# Altium schematic sheet Schematic.SchDoc
size 420 x 297 mm; SheetNumber: 3; SheetTotal: 4
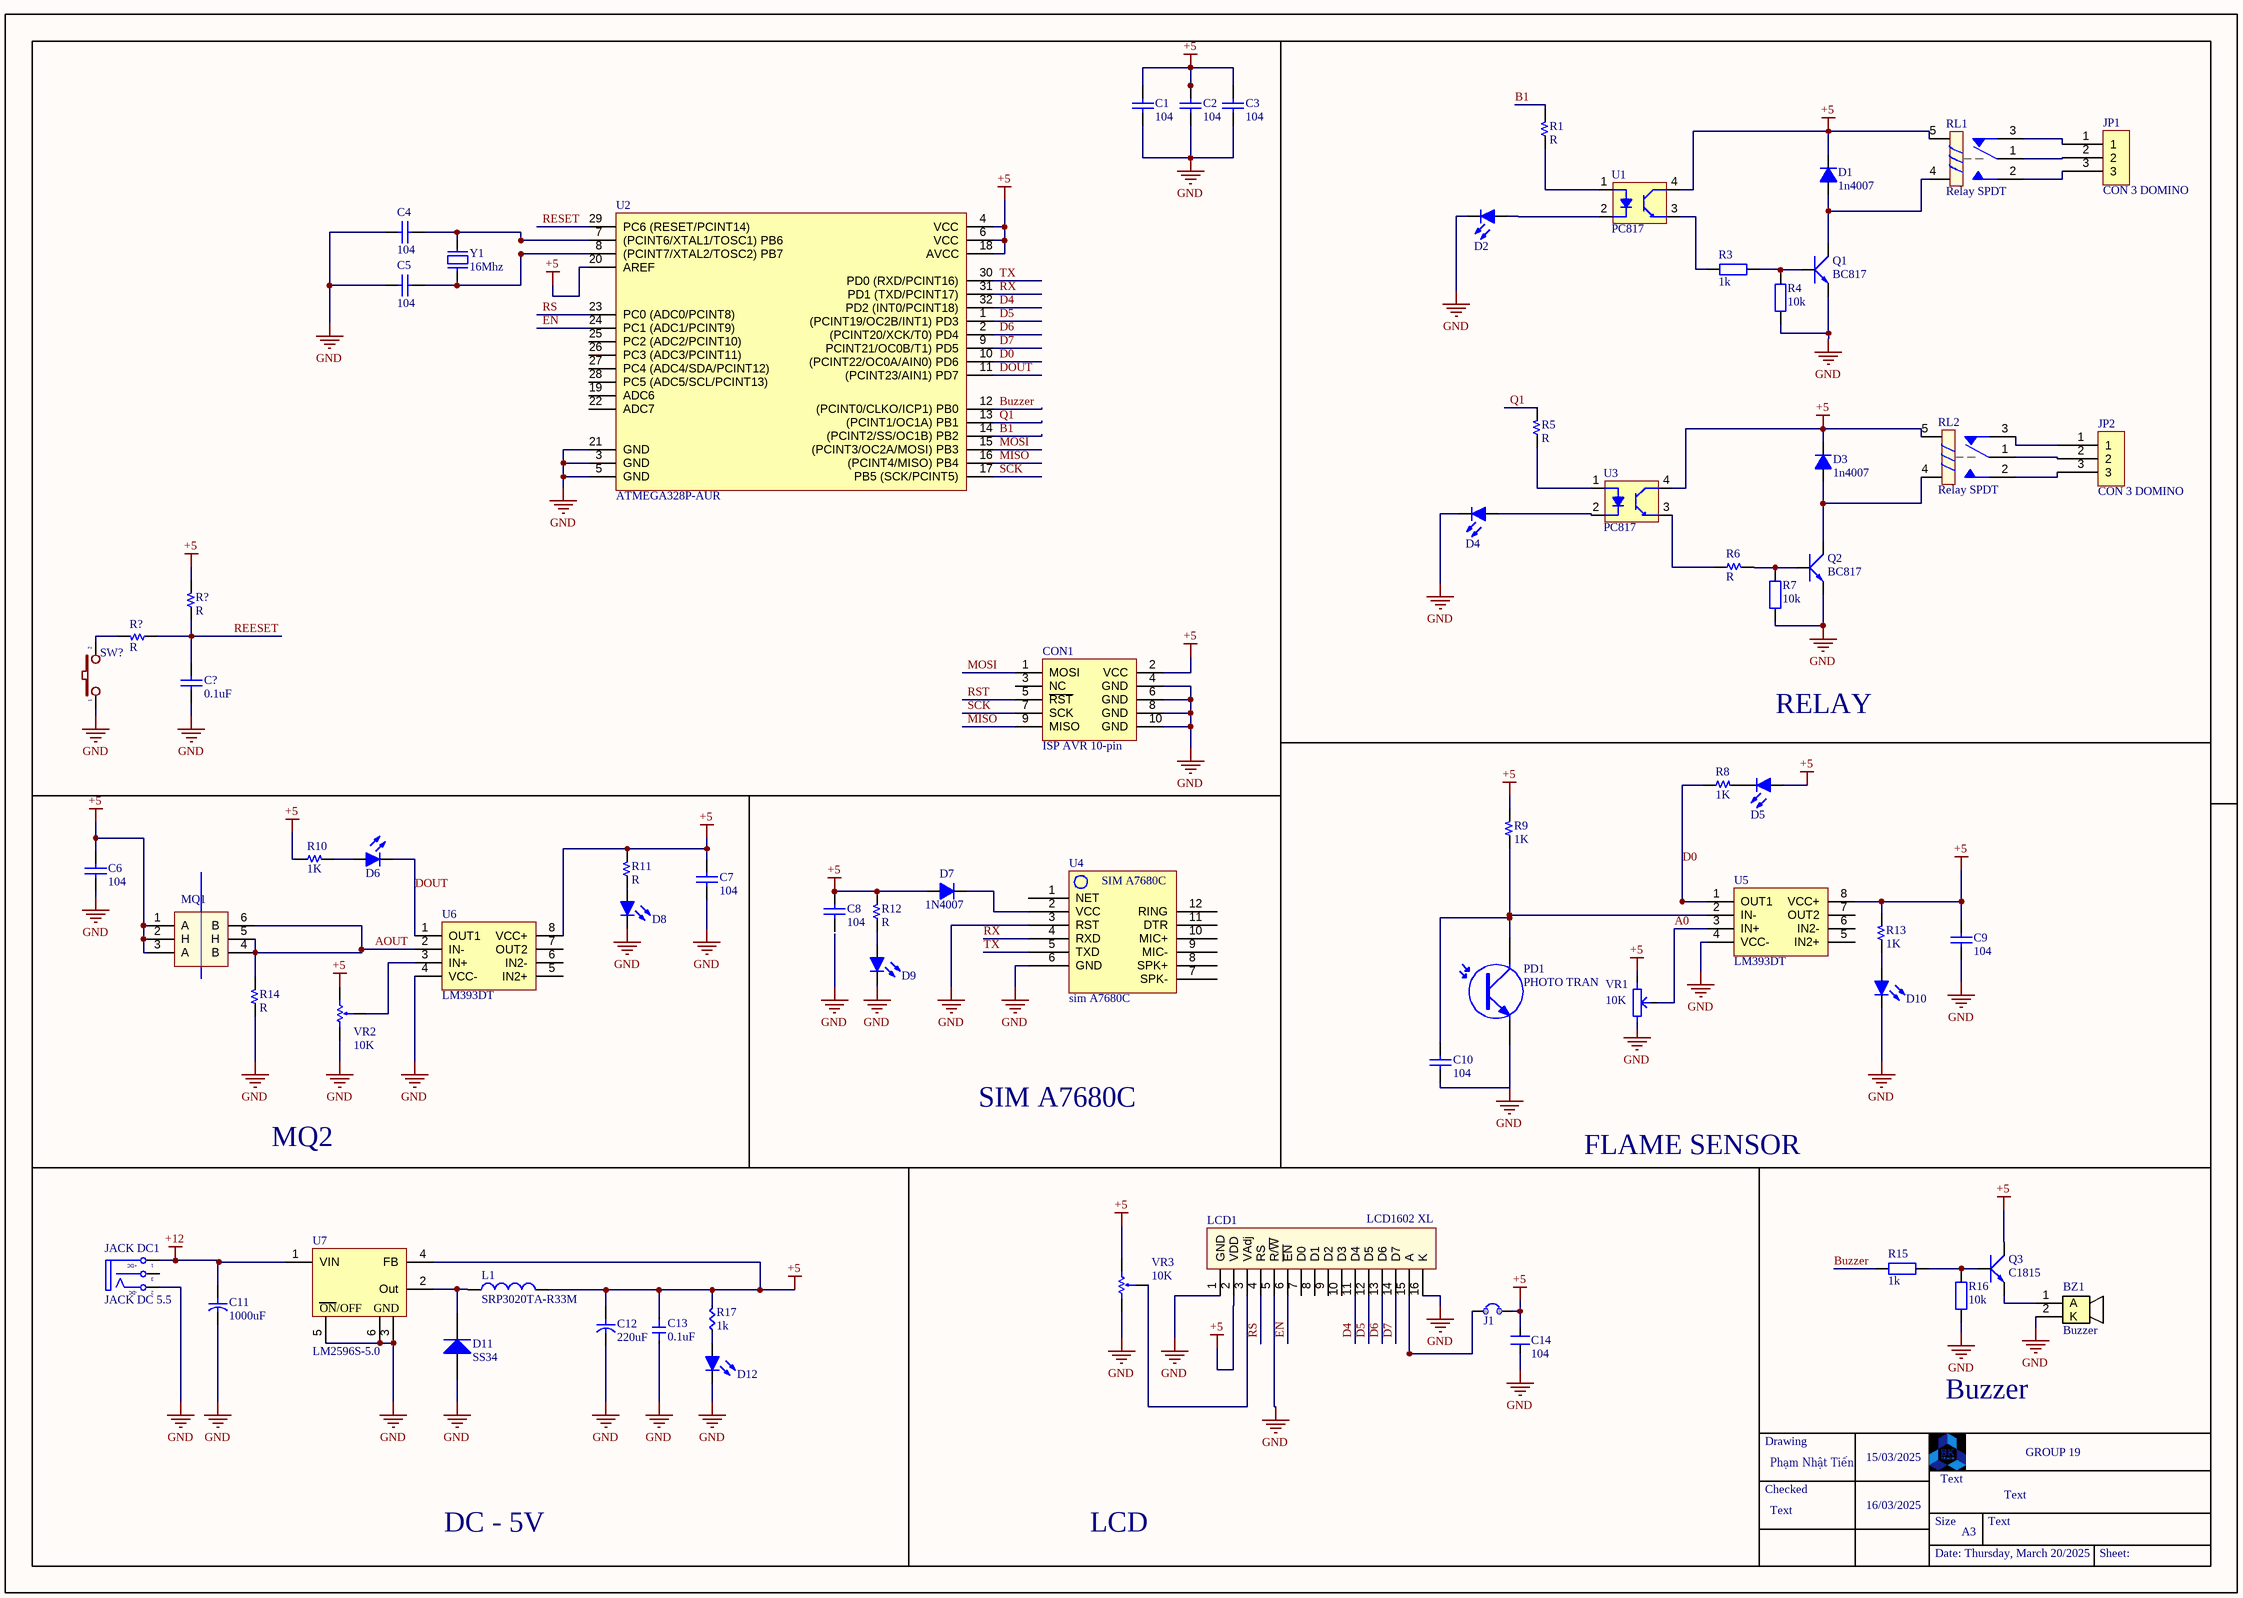
[diagram p0: Schematic.SchDoc]

## Parts
(Parts that share a designator on the sheet are numbered #1, #2 ... from top to bottom, then left to right.)
BZ1  Buzzer  [BUZZER-2]
C1  104  [tu 0805]
C2  104  [tu 0805]
C3  104  [tu 0805]
C4  104  [tu 1206]
C5  104  [tu 1206]
C6  104  [tu 1206]
C7  104  [tu 1206]
C8  104  [tu 1206]
C9  104  [tu 1206]
C10  104  [tu 0805]
C11  1000uF  [C SMD ALU (F) DUAL]
C12  220uF  [C SMD ALU (F) DUAL]
C13  0.1uF  [Cap 0201]
C14  104  [SM-0805]
C?  value 0.1uF  [C3MM]  (hidden comment: Cap)
CON1  ISP AVR 10-pin  [HDR/Header/10/DL/BOX]
D1  1n4007  [DIODE 1A]
D2  Led  [LED 5MM - RED]  (value not drawn)
D3  1n4007  [DIODE 1A]
D4  Led  [LED 5MM - RED]  (value not drawn)
D5  Led  [Led 0603 - green]  (value not drawn)
D6  Led  [Led 0603 - green]  (value not drawn)
D7  1N4007  [DIODE 1A]
D8  Led  [LED 5MM - GREEN]  (value not drawn)
D9  Led  [LED 5MM - GREEN]  (value not drawn)
D10  Led  [Led 0603 - green]  (value not drawn)
D11  SS34  [DIODE SMA]
D12  Led  [LED 5MM - RED]  (value not drawn)
J1  JUMP 2  [JUMP/2/Close]  (value not drawn)  (no BOM)
JACK_DC1  JACK DC 5.5  [JACK DC 5.5]
JP1  CON 3 DOMINO  [CON 3]
JP2  CON 3 DOMINO  [CON 3]
L1  SRP3020TA-R33M  [IND_456_640_236X117_SMD]
LCD1  LCD1602 XL  [LCD1602 with Jump]
MQ1  (no value)  [MQx]
PD1  PHOTO TRAN  [LED-5TRED]
Q1  BC817  [SOT-23]
Q2  BC817  [SOT-23]
Q3  C1815  [TO92]
R1  R  [R 1206]
R3  1k  [tro vach 1/4w]
R4  10k  [tro vach 1/4w]
R5  R  [R 1206]
R6  R  [R 1206]
R7  10k  [tro vach 1/4w]
R8  1K  [R 0603]
R9  1K  [R 0603]
R10  1K  [R 0402 (1005)]
R11  R  [R 1/4W/300]
R12  R  [R 1/4W/300]
R13  1K  [R 0603]
R14  R  [R 0402 (1005)]
R15  1k  [tro vach 1/4w]
R16  10k  [tro vach 1/4w]
R17  1k  [RES 0402]
R?#1  R  [R 1/4W/300]
R?#2  R  [R 1/4W/300]
RL1  Relay SPDT  [RL_SPDT_10A]
RL2  Relay SPDT  [RL_SPDT_10A]
SW?  SW  [SW2]  (value not drawn)
U1  PC817  [SOP4 - PC817]
U2  ATMEGA328P-AUR  [TQFP-32]
U3  PC817  [SOP4 - PC817]
U4  sim A7680C  [SIM A7680C]
U5  LM393DT  [SOIC8_50_328_25X90_SMT]
U6  LM393DT  [SOIC8_50_328_25X90_SMT]
U7  LM2596S-5.0  [TO-263-5]
VR1  10K  [Bien Tro Tam Giac Dung]
VR2  10K  [R VAR A 3D]
VR3  10K  [R VAR A 3D]
Y1  16Mhz  [Thach Anh 2 chan SMD]

## Nets
+5: C1.1 C2.2 C3.1 C6.2 C7.2 C8.2 C9.1 C12.1 C13.1 C14.2 CON1.2(VCC) D1.2(K) D3.2(K) D5.1(A) D7.1(A) J1.2 L1.2 LCD1.2(VDD) MQ1.1(A) MQ1.2(H) MQ1.3(A) Q3.2(C) R9.2 R10.1 R11.2 R12.2 R13.2 R17.2 R?#1.2 RL1.5(COIL2) RL2.5(COIL2) U1.4(C) U2.4(VCC) U2.6(VCC) U2.18(AVCC) U2.20(AREF) U3.4(C) U5.8(VCC+) U6.8(VCC+) U7.4(FB) VR1.1 VR2.1 VR3.1
+12: C11.1 JACK_DC1.1(T) U7.1(VIN)
GND: BZ1.2(K) C1.2 C2.1 C3.2 C4.2 C5.2 C6.1 C7.1 C9.2 C10.2 C11.2 C12.2 C13.2 C14.1 C?.1 CON1.4(GND) CON1.6(GND) CON1.8(GND) CON1.10(GND) D2.2(K) D4.2(K) D8.2(K) D9.2(K) D10.2(K) D11.1(A) D12.2(K) JACK_DC1.2(TN) LCD1.1(GND) LCD1.5(R/~{W}) LCD1.16(K) PD1.2(E) Q1.2(E) Q2.2(E) R4.1 R7.1 R14.1 R16.1 SW?.1 U2.3(GND) U2.5(GND) U2.21(GND) U4.3(RST) U4.6(GND) U5.4(VCC-) U6.4(VCC-) U7.3(GND) U7.5(~{ON}/OFF) U7.6(PAD) VR1.3 VR2.3 VR3.3
A0: U5.3(IN+) VR1.2
AOUT: MQ1.4(B) MQ1.5(H) MQ1.6(B) R14.2 U6.2(IN-)
B1: R1.2 U2.14((PCINT2/SS/OC1B)_PB2)
Buzzer: R15.1 U2.12((PCINT0/CLKO/ICP1)_PB0)
D0: R8.1 U2.10((PCINT22/OC0A/AIN0)_PD6) U5.1(OUT1)
D4: LCD1.11(D4) U2.32(PD2_(INT0/PCINT18))
D5: LCD1.12(D5) U2.1((PCINT19/OC2B/INT1)_PD3)
D6: LCD1.13(D6) U2.2((PCINT20/XCK/T0)_PD4)
D7: LCD1.14(D7) U2.9(PCINT21/OC0B/T1)_PD5)
DOUT: D6.2(K) U2.11((PCINT23/AIN1)_PD7) U6.1(OUT1)
EN: LCD1.6(~{EN}) U2.24(PC1_(ADC1/PCINT9))
MISO: CON1.9(MISO) U2.16((PCINT4/MISO)_PB4)
MOSI: CON1.1(MOSI) U2.15((PCINT3/OC2A/MOSI)_PB3)
Q1: R5.2 U2.13((PCINT1/OC1A)_PB1)
REESET: C?.2 R?#1.1 R?#2.1
RESET: U2.29(PC6_(RESET/PCINT14))
RS: LCD1.4(RS) U2.23(PC0_(ADC0/PCINT8))
RST: CON1.5(~{RST})
RX: U2.31(PD1_(TXD/PCINT17)) U4.4(RXD)
SCK: CON1.7(SCK) U2.17(PB5_(SCK/PCINT5))
TX: U2.30(PD0_(RXD/PCINT16)) U4.5(TXD)
NetBZ1_1: BZ1.1(A) Q3.1(E)
NetC4_1: C4.1 U2.7((PCINT6/XTAL1/TOSC1)_PB6) Y1.2
NetC5_1: C5.1 U2.8((PCINT7/XTAL2/TOSC2)_PB7) Y1.1
NetC10_1: C10.1 PD1.1(C) R9.1 U5.2(IN-)
NetD1_1: D1.1(A) Q1.3(C) RL1.4(COIL1)
NetD2_1: D2.1(A) U1.2(K)
NetD3_1: D3.1(A) Q2.3(C) RL2.4(COIL1)
NetD4_1: D4.1(A) U3.2(K)
NetD5_2: D5.2(K) R8.2
NetD6_1: D6.1(A) R10.2
NetD7_2: D7.2(K) U4.2(VCC)
NetD8_1: D8.1(A) R11.1
NetD9_1: D9.1(A) R12.1
NetD10_1: D10.1(A) R13.1
NetD11_2: D11.2(K) L1.1 U7.2(Out)
NetD12_1: D12.1(A) R17.1
NetJ1_1: J1.1 LCD1.15(A)
NetJP1_1: JP1.1 RL1.3(NC)
NetJP1_2: JP1.2 RL1.1(COM)
NetJP1_3: JP1.3 RL1.2(NO)
NetJP2_1: JP2.1 RL2.3(NC)
NetJP2_2: JP2.2 RL2.1(COM)
NetJP2_3: JP2.3 RL2.2(NO)
NetLCD1_3: LCD1.3(VAdj) VR3.2
NetQ1_1: Q1.1(B) R3.2 R4.2
NetQ2_1: Q2.1(B) R6.2 R7.2
NetQ3_3: Q3.3(B) R15.2 R16.2
NetR1_1: R1.1 U1.1(A)
NetR3_1: R3.1 U1.3(E)
NetR5_1: R5.1 U3.1(A)
NetR6_1: R6.1 U3.3(E)
NetR?#2_2: R?#2.2 SW?.2
NetU6_3: U6.3(IN+) VR2.2

Not connected (* = marked no-connect by the designer): C8 1; CON1 3(NC); JACK_DC1 3(S); LCD1 7(D0) 8(D1) 9(D2) 10(D3); U2 19(ADC6) 22(ADC7) 25(PC2_(ADC2/PCINT10)) 26(PC3_(ADC3/PCINT11)) 27(PC4_(ADC4/SDA/PCINT12)) 28(PC5_(ADC5/SCL/PCINT13)); U4 1(NET) 7(SPK-) 8(SPK+) 9(MIC-) 10(MIC+) 11(DTR) 12(RING); U5 5(IN2+) 6(IN2-) 7(OUT2); U6 5(IN2+) 6(IN2-) 7(OUT2)

## Notes on the sheet
- RELAY
- SIM A7680C
- MQ2
- FLAME SENSOR
- Buzzer
- DC - 5V
- LCD
- Drawing
- Phạm Nhật Tiến
- 15/03/2025
- Text
- GROUP 19
- Checked
- 16/03/2025
- Size
- A3
- Date: Thursday, March 20/2025
- Sheet:
- (in symbol JACK DC 5.5) +DC; -DC
- (in symbol LM2596S-5.0) ON/OFF
- (in symbol sim A7680C) SIM A7680C

## Library data of the parts
C1-C3 C10 = Tu 0805 104 50V 10%: Dán; Don_Vi: Con; So_Chan: 2; Ten_Linh_Kien: Tụ 0805 104-100nF 10% 50V; Ma_Hang: MH004551; Chung_Loai: Dán; Kieu_Chan: *
C4-C9 = Tu 1206 104 50V 20%: Dán; Don_Vi: Con; So_Chan: 2; Ten_Linh_Kien: Tụ 1206 104-0.1uF 20% 50V; Ma_Hang: MH004544; Chung_Loai: Dán; Kieu_Chan: *
C11 C12 = Capacitor: Capacitor pol
C13 = Cap 0201: Capacitor SMD 0201
C14 = CM: Cap SMD; Value: 103
C? = Cap_1: Capacitor; Published: 8-Jun-2000; LatestRevisionDate: 17-Jul-2002; LatestRevisionNote: Re-released for DXP Platform.; PackageReference: RAD-0.3; Publisher: Altium Limited
CON1 = CON ISP AVR 10-pin: ISP AVR 10-pin interface
D1 D3 D7 = Diode 1N4007: Cắm; Ten_Linh_Kien: Diode 1N4007 1A (DIP); Don_Vi: Con; Ma_Hang: MH001063; Ghi Chu: *; Kieu_Chan: *; Chung_Loai: Cắm
D2 D4-D6 D8-D10 D12 = Led: Typical LED
D11 = Diode SS34 ( 1N5822 ): Dán; Don_Vi: Con; Ma_Hang: MH002104; Ten_Linh_Kien: Diode SS34 3A 40V SMA ( 1N5822 SS34A); Kieu_Chan: *; Chung_Loai: Dán
JACK_DC1 = JACK DC 5.5: Value: Jac DC
L1 = IND_33uH-8A-30%-SMD: Fixed Inductors 0.33uH 20% 8A; Manufacturer: Coilcraft; Alternate Part Number-1: NA; Manufacturer Part Number: SRP3020TA-R33M; Case/Package: SMD; Supplier-1: COILCRAFT SAMPLE; Supplier Part Number-1: SER2918H-333KL
LCD1 = LCD1602 XL: LCD 1602 Xanh Lá; Ten: Màn hình LCD 1602 Xanh Lá; Ma_Hang: 67HZ; NCC: NSHOP; CHIP: HD44780
MQ1 = MQX
Q1 Q2 = Trans BC817: SOT-23 - C8658; Value: C9014
Q3 = Trans C1815 DIP: NPN transistor; Value: C9014
R1 R5 R6 R8-R14 R?#1 R?#2 = Resistor
R3 = Tro Vach 1/4W 5% 1k: Cắm; Don_Vi: Con; So_Chan: 2; Ten_Linh_Kien: Trở Vạch 1/4w 5% 1k; Ma_Hang: MH007390; Chung_Loai: Cắm; Kieu_Chan: *
R4 R7 = Tro Vach 1/4W 1% 10k: Cắm; Don_Vi: Con; So_Chan: 2; Ten_Linh_Kien: Trở Vạch 1/4w 1% 10k; Ma_Hang: MH006349; Chung_Loai: Cắm; Kieu_Chan: *
R15 = Tro Vach 1/4W 5% 1R: Cắm; Don_Vi: Con; So_Chan: 2; Ten_Linh_Kien: Trở Vạch 1/4w 5% 1R; Ma_Hang: MH007394; Chung_Loai: Cắm; Kieu_Chan: *
R16 = Tro Vach 1/4W 5% 10k: Căm; Chung_Loai: Cắm; Don_Vi: Con; So_Chan: 2; Ten_Linh_Kien: Trở Vạch 1/4w 5% 10K; Ma_Hang: MH007354; Kieu_Chan: *
R17 = RES 0402: RES SMD 0402; Manufacturer: Vishay Dale; Manufacturer Part Number: CRCW040210K0FKED; Resistance (Ohms): 10k; Tolerance: ±1%; Power (Watts): 0.063W, 1/16W; Temperature Coefficient: ±100ppm/°C; Supplier 1: Digi-Key; RoHS: RoHS Compliant; Category: Resistors; Stock 1: 2392462; Pricing 1: 10=0.083, 50=0.0444, 200=0.0255, 1000=0.0174 (USD); Packaging: Cut Tape (CT); Composition: Thick Film; Features: Automotive AEC-Q200; Operating Temperature: -55°C ~ 155°C; Package / Case: 0402 (1005 Metric); Supplier Device Package: 0402 (1005 Metric); Size / Dimension: 0.039" L x 0.020" W (1.00mm x 0.50mm); Height: 0.016" (0.40mm); Number of Terminations: 2; ComponentLink1URL: http://www.vishay.com/docs/20035/dcrcwe3.pdf; ComponentLink1Description: http://www.vishay.com/docs/20035/dcrcwe3.pdf; Supplier Part Number 1: 541-10.0KLCT-ND
SW? = SW2: Switch button 2 pin; Value: SW chip 2 pin
U1 U3 = PC817: Opto PC817B
U2 = IC_ATMEGA328P: AVR AVR® ATmega Microcontroller IC 8-Bit 20MHz 32KB (16K x 16) FLASH 32-TQFP (7x7); Manufacturer: Microchip Technology; Alternate Part Number-1: NA; Manufacturer Part Number: ATMEGA328P-AUR; Case/Package: 32-TQFP; Supplier-1: Arrow; Supplier Part Number-1: ATMEGA328P-AUR
U5 U6 = IC_LM393DT: Comparator General Purpose CMOS, DTL, ECL, MOS, Open-Collector, TTL 8-SO; Manufacturer: Texas Instruments; Alternate Part Number-1: NA; Manufacturer Part Number: LM393DT; Case/Package: SOIC8; Supplier-1: ARROW; Supplier Part Number-1: LM393DT
U7 = LM2596S-5.0: Simple Switcher 3A Step-Down Voltage Regulator
VR1 = Bien tro tam giac 10K Dung: Cắm; Ma_Hang: MH000919; Don_Vi: Con; Ten_Linh_Kien: Biến Trở Tam Giác 103-10K RM065 (Chân Đứng); Chung_Loai: Cắm; Kieu_Chan: *
VR2 VR3 = Resistor Variable
Y1 = Thach Anh 2 chan SMD: Crystal For all Crystal 2pin.; Value: 4Mhz
PD1 = Photo TRAN: Published: 24-Mar-1999; LatestRevisionDate: 17-Jul-2002; LatestRevisionNote: Re-released for DXP Platform.; PackageReference: TO-220_A; Publisher: Altium Limited; Code_JEDEC: TO-220-AC